# Altium schematic sheet InputCircuits1.SchDoc
size A4; SheetNumber: 4; SheetTotal: 6
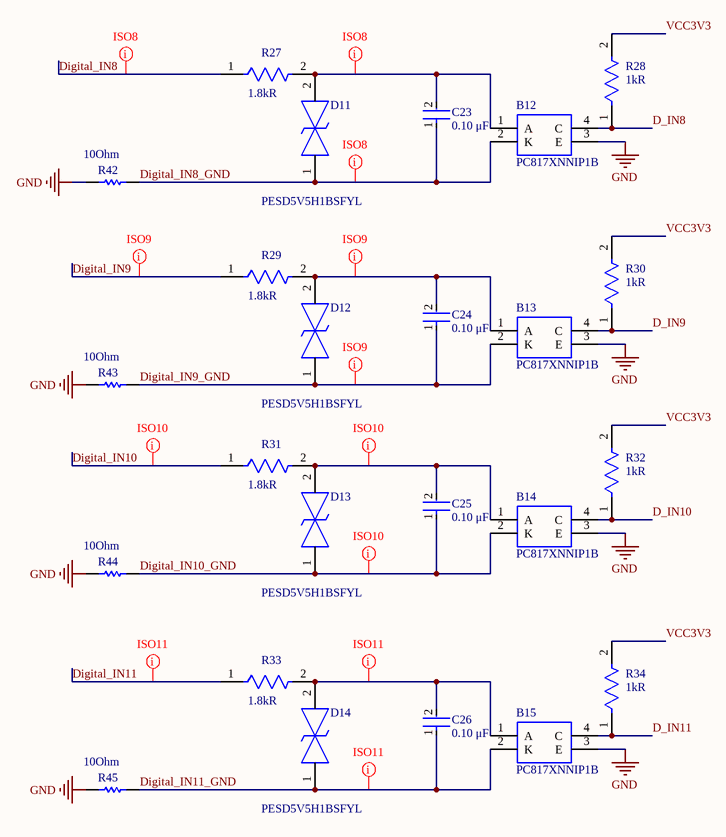
[diagram p0: InputCircuits1.SchDoc]

## Parts
B12  PC817XNNIP1B  [SOP254P960X420-4N]
B13  PC817XNNIP1B  [SOP254P960X420-4N]
B14  PC817XNNIP1B  [SOP254P960X420-4N]
B15  PC817XNNIP1B  [SOP254P960X420-4N]
C23  value 0.10 μF  [FP-C0805C-DN-MFG]  (hidden comment: C0805C104K5RAC7411)
C24  value 0.10 μF  [FP-C0805C-DN-MFG]  (hidden comment: C0805C104K5RAC7411)
C25  value 0.10 μF  [FP-C0805C-DN-MFG]  (hidden comment: C0805C104K5RAC7411)
C26  value 0.10 μF  [FP-C0805C-DN-MFG]  (hidden comment: C0805C104K5RAC7411)
D11  PESD5V5H1BSFYL  [PESD5V0H1BSFYL]
D12  PESD5V5H1BSFYL  [PESD5V0H1BSFYL]
D13  PESD5V5H1BSFYL  [PESD5V0H1BSFYL]
D14  PESD5V5H1BSFYL  [PESD5V0H1BSFYL]
R27  Resistance: 1.8kR  [FP-RC0603-0_55-IPC_C]  (hidden comment: RC0603FR-071K8L)
R28  Resistance: 1kR  [FP-RC0603-0_55-IPC_C]  (hidden comment: RC0603FR-071KL)
R29  Resistance: 1.8kR  [FP-RC0603-0_55-IPC_C]  (hidden comment: RC0603FR-071K8L)
R30  Resistance: 1kR  [FP-RC0603-0_55-IPC_C]  (hidden comment: RC0603FR-071KL)
R31  Resistance: 1.8kR  [FP-RC0603-0_55-IPC_C]  (hidden comment: RC0603FR-071K8L)
R32  Resistance: 1kR  [FP-RC0603-0_55-IPC_C]  (hidden comment: RC0603FR-071KL)
R33  Resistance: 1.8kR  [FP-RC0603-0_55-IPC_C]  (hidden comment: RC0603FR-071K8L)
R34  Resistance: 1kR  [FP-RC0603-0_55-IPC_C]  (hidden comment: RC0603FR-071KL)
R42  Resistance: 10Ohm  [RESC2013X60X35ML10T20]  (hidden comment: RC0805FR-0710RL)
R43  Resistance: 10Ohm  [RESC2013X60X35ML10T20]  (hidden comment: RC0805FR-0710RL)
R44  Resistance: 10Ohm  [RESC2013X60X35ML10T20]  (hidden comment: RC0805FR-0710RL)
R45  Resistance: 10Ohm  [RESC2013X60X35ML10T20]  (hidden comment: RC0805FR-0710RL)

## Nets
GND: B12.3(E) B13.3(E) B14.3(E) B15.3(E) R42.1 R43.1 R44.1 R45.1
D_IN8: B12.4(C) R28.1
D_IN9: B13.4(C) R30.1
D_IN10: B14.4(C) R32.1
D_IN11: B15.4(C) R34.1
Digital_IN8: R27.1
Digital_IN8_GND: B12.2(K) C23.1 D11.1 R42.2
Digital_IN9: R29.1
Digital_IN9_GND: B13.2(K) C24.1 D12.1 R43.2
Digital_IN10: R31.1
Digital_IN10_GND: B14.2(K) C25.1 D13.1 R44.2
Digital_IN11: R33.1
Digital_IN11_GND: B15.2(K) C26.1 D14.1 R45.2
VCC3V3: R28.2 R30.2 R32.2 R34.2
NetB12_1: B12.1(A) C23.2 D11.2 R27.2
NetB13_1: B13.1(A) C24.2 D12.2 R29.2
NetB14_1: B14.1(A) C25.2 D13.2 R31.2
NetB15_1: B15.1(A) C26.2 D14.2 R33.2

## Layout directives
net class ISO8: Digital_IN8, Digital_IN8_GND, NetB12_1
net class ISO9: Digital_IN9, Digital_IN9_GND, NetB13_1
net class ISO10: Digital_IN10, Digital_IN10_GND, NetB14_1
net class ISO11: Digital_IN11, Digital_IN11_GND, NetB15_1

## Library data of the parts
B12-B15 = PC817XNNIP1B: Transistor Output Optocouplers Photocoupler; Manufacturer_Name: Sharp Microelectronics; Geometry.Height: 4.2mm; Mouser Part Number: 852-PC817XNNIP1B; Mouser Price/Stock: https://www.mouser.co.uk/ProductDetail/Sharp-Microelectronics/PC817XNNIP1B?qs=rrS6PyfT74dJvnx7366b6Q%3D%3D; Manufacturer_Part_Number: PC817XNNIP1B; Datasheet Link: *
C23-C26 = CMP-2007-00277-3: C0805 0.10 μF X7R 30ppm/°C 10.00% 50 V; Manufacturer: KEMET; Material: Ceramic; Tolerance: 0.1; Voltage Rating: 50 V; Temperature: -55°C to +125°C; Device Class L3: Ceramic Capacitors; Temperature Characteristic: X7R; Device Class L1: Passive Components; Category: Cap; Temperature Coefficient: 30ppm/°C; Manufacturer Part Number: C0805C104K5RAC7411; Temperature Range High: +125°C; Height: 0.88mm; RoHS: TRUE; ComponentLink2Description: Datasheet; Lead Free: Yes; Capacitance: 0.10 μF; Package: C0805C-DN; Temperature Range Low: -55°C; ComponentLink2URL: https://content.kemet.com/datasheets/KEM_C1003_C0G_SMD.pdf; Automotive: No; Ipc Land Pattern Name: CAPC200125X78; Octopart: https://octopart.com/c0805c104k5rac7411-kemet-18508045; Device Class L2: Capacitors
D11-D14 = PESD5V5H1BSFYL: ESD Suppressors / TVS Diodes; Manufacturer_Name: Nexperia; Geometry.Height: 0.325mm; Mouser Part Number: 771-PESD5V5H1BSFYL; Mouser Price/Stock: https://www.mouser.co.uk/ProductDetail/Nexperia/PESD5V5H1BSFYL?qs=T3oQrply3y9CfA%2FMHqAcog%3D%3D; Manufacturer_Part_Number: PESD5V5H1BSFYL; Datasheet Link: https://assets.nexperia.com/documents/data-sheet/PESD5V0H1BSF.pdf
R27 R29 R31 R33 = CMP-2000-06931-2: RES SMD 1.8K OHM 1% 1/10W 0603; Power Rating: 100mW; Voltage Rating (DC): 50V; Temperature Coefficient: 100ppm/°C; REACH SVHC: No SVHC; Construction: Rectangular; Resistance Tolerance: 1%; Package Quantity: 5000; Tolerance: 1%; Min Operating Temperature: -55°C; Case Code (Metric): 1608; Number of Terminations: 2; Case/Package: 0603; Number of Pins: 2; Max Power Dissipation: 100mW; Max Operating Temperature: 155°C; Technology: THICK FILM; Resistor Type: Thick Film; Voltage Rating: 50V; Depth: 0.8mm; Size Code: 0603; Width: 0.8mm; Features: Moisture Resistant; Lead Free: Lead Free; Height: 0.45mm; RoHS Compliant: Yes; Termination: SMD/SMT; Military Standard: Not; Case Code (Imperial): 0603; Packaging: Tape and Reel; Series: RC; Length: 1.6mm
R28 R30 R32 R34 = CMP-1659-00009-5: RES 1K OHM 1% 1/10W 0603; Voltage Rating: 50V; Power Rating: 100mW; Temperature Coefficient: 100ppm/°C; Military Standard: Not; REACH SVHC: No SVHC; Size Code: 0603; Features: Moisture Resistant; Number of Terminations: 2; Technology: THICK FILM; Series: RC; Case Code (Metric): 1608; Resistance Tolerance: 1%; Resistor Type: Thick Film; Termination: SMD/SMT; Contact Plating: Tin; Radiation Hardening: No; Min Operating Temperature: -55°C; Max Operating Temperature: 155°C; Packaging: Tape and Reel; Max Power Dissipation: 100mW; RoHS Compliant: Yes; Height: 0.45mm; Lead Free: Lead Free; Case/Package: 0603; Length: 1.6mm; Tolerance: 1%; Case Code (Imperial): 0603; Construction: Rectangular; Depth: 0.8mm
R42-R45 = CMP-2100-03670-1: Chip Resistor, 10 Ohm, +/- 1%, 0.125 W, -55 to 155 degC, 0805 (2012 Metric), RoHS, Tape and Reel; Manufacturer: Yageo; Power Rating: 125mW; Voltage Rating: 150V; Temperature Coefficient: 200ppm/degreesC; Number of Pins: 2; REACH SVHC: NoSVHC; Datasheet Version: Rev. 5, 10/2016; Max Operating Temperature: 155degC; Manufacturer URL: http://www.yageo.com/; Case Code (Imperial): 0805; Package Description: 2-Pin Surface Mounted Device, Body 2 x 1.25 mm; Case Code (Metric): 2012; Length: 2mm; RoHSCompliant: true; Max Power Dissipation: 125mW; Depth: 1.25mm; Packaging: TapeandReel; Height: 0.5mm; Package Reference: 0805; Package Quantity: 1; Tolerance: 1%; Termination: SMD/SMT; Min Operating Temperature: -55degC; Lead Free: LeadFree; Width: 1.25mm; Voltage Rating (DC): 150V; Datasheet URL: http://www.yageo.com/NewPortal/yageodocoutput?fileName=/pdf/R-Chip/PYu-RC_Group_51_RoHS_L_5.pdf; Composition: ThickFilm; Number of Terminations: 2; Case/Package: 0805